# Altium schematic sheet POWER.SchDoc: =DocumentName
size 420 x 297 mm; CompanyName: "AS Manufacturing" LLC; Organization: "AS Manufacturing" LLC; Address1: 5 Sklyarenka St.; Address2: Kyiv 04073; Address3: Ukraine; Address4: https://ajax.systems/en/; DocumentNumber: 3; SheetNumber: 3; SheetTotal: 4; Template_version: 1.0.1
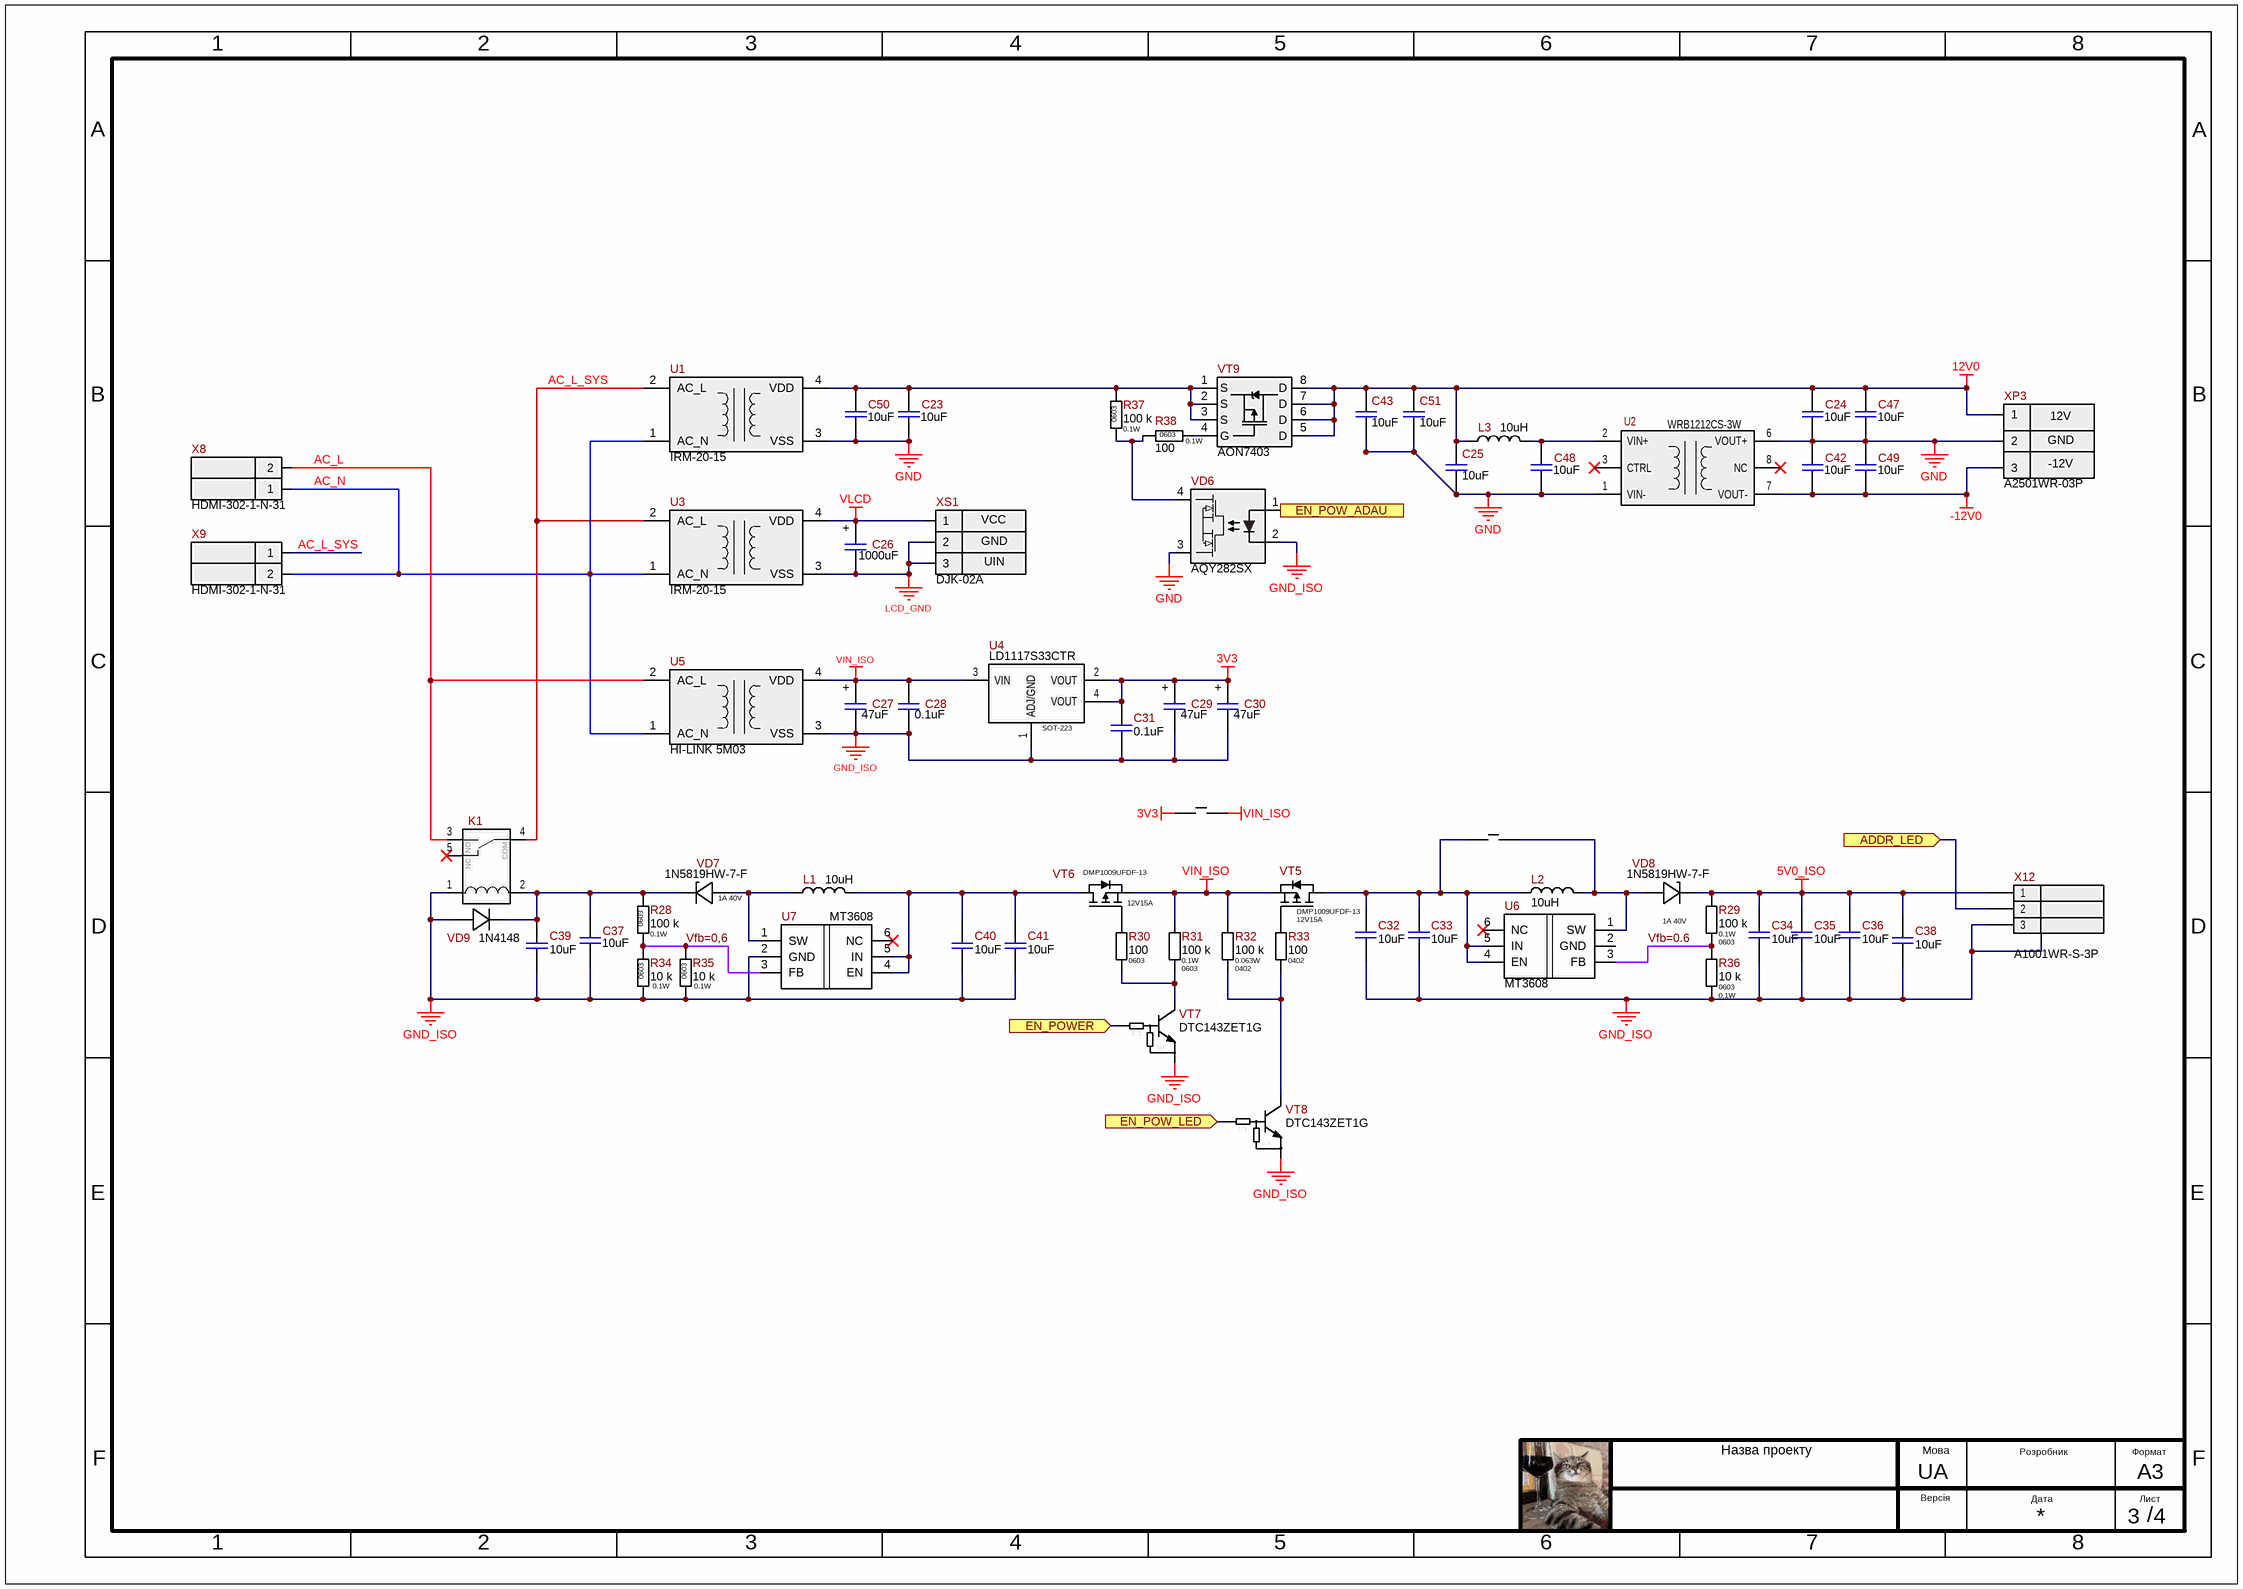
[diagram p0: POWER.SchDoc]

## Parts
C23  10uF  [C0805(2012)]
C24  10uF  [C0805(2012)]
C25  10uF  [C0805(2012)]
C26  1000uF  [CAP 10x16]
C27  47uF  [CASE_C(6032)]
C28  0.1uF  [C0603(1608)]
C29  47uF  [CASE_C(6032)]
C30  47uF  [CASE_C(6032)]
C31  0.1uF  [C0402(1005)]
C32  10uF  [C0805(2012)]
C33  10uF  [C0805(2012)]
C34  10uF  [C0805(2012)]
C35  10uF  [C0805(2012)]
C36  10uF  [C0805(2012)]
C37  10uF  [C0805(2012)]
C38  10uF  [C0805(2012)]
C39  10uF  [C0805(2012)]
C40  10uF  [C0805(2012)]
C41  10uF  [C0805(2012)]
C42  10uF  [C0805(2012)]
C43  10uF  [C0805(2012)]
C47  10uF  [C0805(2012)]
C48  10uF  [C0805(2012)]
C49  10uF  [C0805(2012)]
C50  10uF  [C0805(2012)]
C51  10uF  [C0805(2012)]
K1  LEG-12  [Relay10A]  (value not drawn)
L1  10uH  [WE-LQS SMD 4018]
L2  10uH  [WE-LQS SMD 4018]
L3  10uH  [WE-LQS SMD 4018]
R28  100 k  Power Rating: 0.1W  Package/Case: 0603  [R0603]
R29  100 k  Power Rating: 0.1W  Package/Case: 0603  [R0603]
R30  100  Package/Case: 0603  [R0603]
R31  100 k  Power Rating: 0.1W  Package/Case: 0603  [R0603]
R32  100 k  Power Rating: 0.063W  Package/Case: 0402  [R0402]
R33  100  Package/Case: 0402  [R0402]
R34  10 k  Package/Case: 0603  Power Rating: 0.1W  [R0603]
R35  10 k  Package/Case: 0603  Power Rating: 0.1W  [R0603]
R36  10 k  Package/Case: 0603  Power Rating: 0.1W  [R0603]
R37  100 k  Power Rating: 0.1W  Package/Case: 0603  [R0603]
R38  100  Power Rating: 0.1W  Package/Case: 0603  [R0603]
U1  IRM-20-15  [IRM-20-xx_REC]
U2  WRB1212CS-3W  [SIP-8 22.0x9.5x12.0mm 6pin]
U3  IRM-20-15  [IRM-20-xx_REC]
U4  Package: SOT-223  Part Number: LD1117S33CTR  [SOT223]  (hidden comment: LD1117STR)
U5  HI-LINK 5M03  [HLINK_5MXX]
U6  MT3608  [SOT23-6]
U7  MT3608  [SOT23-6]
VD6  AQY282SX  [SOP-4N]
VD7  1N5819HW-7-F  Power Rating: 1A 40V  [SOD-123]
VD8  1N5819HW-7-F  Power Rating: 1A 40V  [SOD-123]
VD9  1N4148  [SOD-80]
VT5  DMP1009UFDF-13  Power Rating: 12V15A  [U-DFN2020-6_SLDR]
VT6  DMP1009UFDF-13  Power Rating: 12V15A  [U-DFN2020-6_SLDR]
VT7  DTC143ZET1G  [SOT-416]
VT8  DTC143ZET1G  [SOT-416]
VT9  AON7403  [DFN3X3]
X8  Part Number: HDMI-302-1-N-31  [DG300-7.5-02P-13-02Z(H)]  (hidden comment: DG300-7.5-02P-13-02Z(H))
X9  Part Number: HDMI-302-1-N-31  [DG300-7.5-02P-13-02Z(H)]  (hidden comment: DG300-7.5-02P-13-02Z(H))
X10  Jumper 1.5х2  [NetTie1.5х2]  (value not drawn)  (net tie, no BOM)
X11  Jumper 1.5х2  [NetTie1.5х2]  (value not drawn)  (net tie, no BOM)
X12  A1001WR-S-3P  [A1001WR-S-03P]
XP3  A2501WR-03P  [A2501WR-03P]
XS1  DJK-02A  [DC-140-003]

## Ports
ADDR_LED (in), EN_POW_ADAU (in), EN_POW_LED (in), EN_POWER (in)

## Nets
3V3: C29.1 C30.1 C31.1 U4.2(VOUT) U4.4(VOUT) X10.1
5V0_ISO: C34.1 C35.1 C36.1 C38.1 R29.2 VD8.1(K) X12.1
12V0: C24.1 C25.1 C43.1 C47.1 C51.1 L3.2 VT9.5(D) VT9.6(D) VT9.7(D) VT9.8(D) XP3.1
-12V0: C42.2 C49.2 U2.7(VOUT-) XP3.3
GND: C23.2 C24.2 C25.2 C42.1 C43.2 C47.2 C48.2 C49.1 C50.2 C51.2 U1.3(VSS) U2.1(VIN-) U2.6(VOUT+) VD6.3 XP3.2
GND_ISO: C27.2 C28.2 C29.2 C30.2 C31.2 C32.2 C33.2 C34.2 C35.2 C36.2 C37.2 C38.2 C39.2 C40.2 C41.2 K1.1 R34.1 R35.1 R36.1 U4.1(ADJ/GND) U5.3(VSS) U7.2(GND) VD6.2(GND) VD9.2(A) VT7.2(E) VT8.2(E) X12.3 X12.MP(MountPad)
LCD_GND: C26.2 U3.3(VSS) XS1.2 XS1.3
VIN_ISO: C27.1 C28.1 R31.2 R32.2 U4.3(VIN) U5.4(VDD) VT5.S VT6.S X10.2
VLCD: C26.1 U3.4(VDD) XS1.1
AC_L: K1.3(NO) U5.2(AC_L) X8.2
AC_L_SYS: K1.4(COM) U1.2(AC_L) U3.2(AC_L) X9.1
AC_N: U1.1(AC_N) U3.1(AC_N) U5.1(AC_N) X8.1 X9.2
ADDR_LED: X12.2 ; port ADDR_LED
EN_POW_ADAU: VD6.1(VIN) ; port EN_POW_ADAU
EN_POW_LED: VT8.1(B) ; port EN_POW_LED
EN_POWER: VT7.1(B) ; port EN_POWER
Vfb=0,6: R28.1 R34.2 R35.2 U7.3(FB)
Vfb=0.6: R29.1 R36.2 U6.3(FB)
NetC23_1: C23.1 C50.1 R37.2 U1.4(VDD) VT9.1(S) VT9.2(S) VT9.3(S)
NetC32_1: C32.1 C33.1 L2.1 U6.4(EN) U6.5(IN) VT5.D X11.2
NetC37_1: C37.1 C39.1 K1.2 R28.2 VD7.1(K) VD9.1(K)
NetC40_1: C40.1 C41.1 L1.1 U7.4(EN) U7.5(IN) VT6.D
NetC48_1: C48.1 L3.1 U2.2(VIN+)
NetL1_2: L1.2 U7.1(SW) VD7.2(A)
NetL2_2: L2.2 U6.1(SW) VD8.2(A) X11.1
NetR30_1: R30.1 R31.1 VT7.3(C)
NetR30_2: R30.2 VT6.G
NetR32_1: R32.1 R33.1 VT8.3(C)
NetR33_2: R33.2 VT5.G
NetR37_1: R37.1 R38.2 VD6.4
NetR38_1: R38.1 VT9.4(G)

Not connected (* = marked no-connect by the designer): K1 5(NC)*; U2 3(CTRL)* 8(NC)*; U6 2(GND) 6(NC)*; U7 6(NC)*

## Notes on the sheet
- (near XP3) 12V
- (near XP3) GND
- (near XP3) -12V
- 1
- 2
- 3
- 4
- 5
- 6
- 7
- 8
- A
- B
- C
- D
- E
- F
- Назва проекту
- Мова
- UA
- Розробник
- Формат
- A3
- Версія
- Дата
- Лист
- /
- (in symbol 47uF  20V CASE-C) +
- (in symbol 1000uF  16V 10x16(EHR)) +
- (in symbol DJK-02A) VCC; GND; UIN
- (in symbol DTC143ZET1G) 4.7k; 47k

## Library data of the parts
C23-C25 C32-C43 C47-C51 = 10uF  16V C0805: CAP CER 10UF 16V X6S 0805; Manufacturer: Murata Electronics North America; Manufacturer P/N: GRM21BC81C106KA73L; Name Component: Capacitor Ceramic; Tolerance: ±10%; Operation Temperature: -55°C ~ 105°C; Library Path 1: Capacitors.SchLib; Part Number: 10uF  16V C0805; Value: 10uF; Temperature Coefficient: X6S; Power (V/A): 16V; Package/Case: C0805; Supplier 1: Digi-key; Supplier Part Number 1: 490-5519-2-ND; ComponentLink1Description: Datasheet; ComponentLink1URL: https://www.murata.com/~/media/webrenewal/support/library/catalog/products/capacitor/mlcc/c02e.ashx?la=en-us
C26 = 1000uF  16V 10x16(EHR): 1000uF 20% 16V EHR 10x16mm; Manufacturer: Hitano; Manufacturer P/N: EHR102M16BA; Name Component: Electrolytic capacitor; Operation Temperature: −40°C to +105°C; Library Path 1: Capacitors.SchLib; Part Number: 1000uF  16V 10x16(EHR); Value: 1000uF; Tolerance: ±20%; Power (V/A): 16V; Package/Case: 10x16(EHR); Supplier 1: RCS; ComponentLink1Description: Datasheet; ComponentLink1URL: https://www.rcscomponents.kiev.ua/datasheets/EHR_081225.pdf
C27 C29 C30 = 47uF  20V CASE-C: CAP TANT 47UF 10% 20V 2312; Manufacturer: KEMET; Manufacturer P/N: T491C476K020AT; Name Component: CapacitorTantalum; Operation Temperature: -55°C ~ 125°C; Library Path 1: Capacitors.SchLib; Part Number: 47uF  20V CASE-C; Value: 47uF; Tolerance: ±10%; Power (V/A): 20V; Package/Case: CASE-C; Temperature Coefficient: -; Supplier 1: Digi-key; Supplier Part Number 1: 399-10176-2-ND; ComponentLink1Description: Datasheet; ComponentLink1URL: https://content.kemet.com/datasheets/KEM_T2005_T491.pdf
C28 = 0.1uF  50V C0603: CAP CER 0.1UF 50V X7R 0603; Manufacturer: Samsung Electro-Mechanics; Manufacturer P/N: CL10B104KB8WPNC; Name Component: Capacitor Ceramic; Tolerance: ±10%; Operation Temperature: -55°C ~ 125°C; Library Path 1: Capacitors.SchLib; Notes: 06035C104K4T4A, 06035C104K4T2A; Part Number: 0.1uF  50V C0603; Value: 0.1uF; Temperature Coefficient: X7R; Power (V/A): 50V; Package/Case: C0603; Supplier Part Number 1: 1276-6854-2-ND; ComponentLink1Description: Datasheet; Supplier 1: Digi-key; ComponentLink1URL: https://www.samsungsem.com/resources/file/global/support/product_catalog/MLCC.pdf
C31 = 0.1uF  25V C0402: CAP CER 0.1UF 25V X7R 0402; Manufacturer: Samsung Electro-Mechanics; Name Component: Capacitor Ceramic; Tolerance: ±10%; Operation Temperature: -55°C ~ 125°C; Library Path 1: Capacitors.SchLib; Part Number: 0.1uF  25V C0402; Value: 0.1uF; Temperature Coefficient: X7R; Power (V/A): 25V; Package/Case: C0402; Supplier Part Number 1: 1276-6854-2-ND; ComponentLink1Description: Datasheet
K1 = LEG-12: General Purpose Relay, 1 Form C (1PDT), 12VDC 400Ohm Coil, 120VAC/24VDC @ 10A, 240VAC Max; Operation Temperature: -55°C ~ 125°C (TA); Power (V/A): 12V; Library Path 1: Others.SchLib; ComponentLink1URL: https://www.tme.eu/Document/311affc211749c2a4c93ad074af62b72/LEG-SERIES.pdf; ComponentLink1Description: Datasheet; Part Number: LEG-12; Name Component: Relay; Value: LEG-12; Supplier Part Number 1: Relay10A
L1-L3 = NRS4018T3R3: FIXED IND 10UH 1A 66 MOHM SMD; Manufacturer: TaiyoYuden; Manufacturer P/N: NRS4018T3R3MDGJ; Name Component: Fixed Inductors; Tolerance: ±20; Operation Temperature: -25°C ~ 120°C; Power (V/A): 2A; Library Path 1: Inductance.SchLib; Part Number: NRS4018T3R3; Value: 10uH; Package/Case: 4.00mm x 4.00mm; Supplier 1: Digi-key; Supplier Part Number 1: 587-2892-2-ND; ComponentLink1Description: Datasheet; ComponentLink1URL: https://www.yuden.co.jp/productdata/catalog/wound04_e.pdf
R28 R29 R31 R37 = 100 k  R0603: RES SMD 100 k OHM  ±1% 1/10W 0603; Name Component: Resistror; Operation Temperature: -55℃ to 155℃; Temperature Coefficient: ±100 ppm/°C; Library Path 1: Resistor.SchLib; Part Number: 100 k  R0603; Value: 100 k; Tolerance: ±1%
R30 = 100  R0603: RES SMD 100 OHM  ±1% 1/10W 0603; Power Rating: 0.1W; Name Component: Resistror; Operation Temperature: -55℃ to 155℃; Temperature Coefficient: ±100 ppm/°C; Library Path 1: Resistor.SchLib; Part Number: 100  R0603; Value: 100; Tolerance: ±1%
R32 = 100 k  R0402: RES SMD 100 k OHM  ±1% 1/16W 0402; Name Component: Resistror; Operation Temperature: -55℃ to 155℃; Temperature Coefficient: ±100 ppm/°C; Library Path 1: Resistor.SchLib; Part Number: 100 k  R0402; Value: 100 k; Tolerance: ±1%
R33 = 100  R0402: RES SMD 100 OHM  ±1% 1/16W 0402; Power Rating: 0.063W; Name Component: Resistror; Operation Temperature: -55℃ to 155℃; Temperature Coefficient: ±100 ppm/°C; Library Path 1: Resistor.SchLib; Part Number: 100  R0402; Value: 100; Tolerance: ±1%
R34-R36 = 10 k  R0603: RES SMD 10 k OHM  ±1% 1/10W 0603; Name Component: Resistror; Operation Temperature: -55℃ to 155℃; Temperature Coefficient: ±100 ppm/°C; Library Path 1: Resistor.SchLib; Part Number: 10 k  R0603; Value: 10 k; Tolerance: ±1%
R38 = 100  R0603: RES SMD 100 OHM  ±1% 1/10W 0603; Name Component: Resistror; Operation Temperature: -55℃ to 155℃; Temperature Coefficient: ±100 ppm/°C; Library Path 1: Resistor.SchLib; Part Number: 100  R0603; Value: 100; Tolerance: ±1%
U1 U3 = IRM-20-15: 15W 85-264V AC-DC PCB-Mount Green Power Module, 15V @ 1.4A; Operation Temperature: -40°C ~ 85°C; Power (V/A): 15 V 1.4A; Library Path 1: Module.SchLib; Part Number: IRM-20-15; Name Component: AC-DC; Value: IRM-20-15; ComponentLink1Description: Datasheet; ComponentLink1URL: https://kosmodrom.ua/storage/pdf/IRM-20.pdf
U2 = WRB1212CS-3W: 3W DC/DC Power Supply, Vout 12V, Size 22.0x9.5x12.0mm; Manufacturer: rlt; Part Number: {Part Number}; Value: *
U4 = LD1117S33CTR: IC REG LINEAR 3.3V 800MA SOT223; Manufacturer: STMicroelectronics; Name Component: Linear Regulators; Operation Temperature: -40°C ~ 125°C; Power (V/A): 0.8 A 3.3 В; Library Path 1: Power converters.SchLib; ComponentDescription: Linear Regulators  LD1117S33CTR  (SOT-223); Part Type: Power / Linear Regulator; Component Type: SMD; Temperature Range: 0°C ~ 125°C; ComponentLink1URL: https://www.st.com/content/ccc/resource/technical/document/datasheet/99/3b/7d/91/91/51/4b/be/CD00000544.pdf/files/CD00000544.pdf/jcr:content/translations/en.CD00000544.pdf; Supplier 1: Digi-key; Supplier Part Number 1: 497-1241-2-ND; Price: 0,11994941; ComponentLink1Description: Datasheet; Value: LD1117S33CTR; Package/Case: SOT-223; Manufacturer P/N: LD1117S33CTR
U5 = HI-LINK 5M03: 85-264VAC  5W 3.3V 1.5A; Name Component: AC-DC; Operation Temperature: -40°C ~ 85°C; Library Path 1: Module.SchLib; Part Number: HI-LINK 5M03; Value: HI-LINK 5M03; Power (V/A): 3.3 V 1.5A; ComponentLink1Description: Datasheet
U6 U7 = MT3608: HIGH EFFICIENCY 1.2MHZ 2A STEP UP CONVERTER; Manufacturer: AEROSEMI; Manufacturer P/N: MT3608 AEROSEMI; Name Component: Power converters; Operation Temperature: -40°C ~ 125°C; Library Path 1: Power converters.SchLib; ComponentDescription: Power converters  MT3608  (SOT23-6); Part Number: MT3608; Value: MT3608; Power (V/A): 2 A; Package/Case: SOT23-6; Supplier 1: -; Supplier Part Number 1: -; ComponentLink1Description: Datasheet; ComponentLink1URL: http://mini-tech.com.ua/download/datasheet/power_supply/MT3608.pdf
VD6 = AQY282SX: SSR RELAY SPST-NO 500MA 0-60V; Manufacturer: Panasonic Electric Works; Name Component: Optotransistor; Operation Temperature: -40 ~ +85; Power (V/A): 0 V ~ 60 V; Library Path 1: Opto.SchLib; Part Number: AQY282SX; Value: AQY282SX; Package/Case: 4-SOP; Supplier 1: Digi-key; ComponentLink1Description: Datasheet; ComponentLink1URL: https://media.digikey.com/pdf/Data%20Sheets/Panasonic%20Electric%20Works%20PDFs/AQW,AQY280,282,284.pdf
VD7 VD8 = 1N5819HW-7-F: DIODE SCHOTTKY 40V 1A SOD-123; Manufacturer: Diodes Incorporated; Library Path 1: Diodes.SchLib; Part Number: 1N5819HW-7-F; Name Component: Diode Schottky; Value: 1N5819HW-7-F; Package/Case: SOD-123; Supplier 1: Kosmodrom; ComponentLink1Description: Datasheet; ComponentLink1URL: https://www.mouser.com/datasheet/2/115/DIOD_S_A0011683586_1-2543674.pdf?srsltid=AfmBOooSNGKg6kFHsm5EDerUk8pACA_mvoqB5hN7nSVKhWQ3aDU_xIdt
VD9 = 1N4148: DIODE GEN PURP 75V 250MA SOD323; Manufacturer: Diodes Incorporated; Operation Temperature: -55°C ~ 150°C; Library Path 1: Diodes.SchLib; Power Rating: 75V 250mA; Part Number: 1N4148; Name Component: Diode; Value: 1N4148; Package/Case: SOD-80; Manufacturer P/N: 1N4148; Supplier 1: Digi-key; Supplier Part Number 1: 1N4148; ComponentLink1Description: Datasheet
VT5 VT6 = DMP1009UFDF-13: P-Channel 12 V 15A (Ta) 2W (Ta) Surface Mount U-DFN2020-6 (Type F); Manufacturer: Diodes Incorporated; Name Component: Transistor; Operation Temperature: -55°C ~ 150°C (TJ); Library Path 1: Transistors.SchLib; ComponentLink1URL: https://www.diodes.com/assets/Datasheets/DMP1009UFDF.pdf; ComponentLink1Description: Datasheet; Part Number: DMP1009UFDF-13; Value: DMP1009UFDF-13; Package/Case: U-DFN2020-6 (Type F); Manufacturer P/N: DMP1009UFDF-13; Supplier 1: Digi-key; Supplier Part Number 1: DMP1009UFDF-13-ND
VT7 VT8 = DTC143ZET1G: TRANS PREBIAS NPN 50V 100MA SC75; Manufacturer: onsemi; Name Component: Transistor; Operation Temperature: -55°C ~ 150°C (TJ); Power Rating: 100mA 50V; Library Path 1: Transistors.SchLib; Part Number: DTC143ZET1G; Value: DTC143ZET1G; Package/Case: SOT-416; Manufacturer P/N: DTC143ZET1G; Supplier 1: Digi-key; Supplier Part Number 1: DTC143ZET1GOSTR-ND; ComponentLink1Description: Datasheet; ComponentLink1URL: https://www.onsemi.com/pdf/datasheet/dtc143z-d.pdf
VT9 = AON7403: P-Channel 30 V 11A (Ta), 29A (Tc) 3.1W (Ta), 25W (Tc) Surface Mount 8-DFN-EP (3x3); Manufacturer: Alpha & Omega Semiconductor Inc.; Name Component: Transistor; Operation Temperature: -55°C ~ 150°C (TJ); Power Rating: 30V 15A; Library Path 1: Transistors.SchLib; Part Number: AON7403; ComponentLink1URL: https://imrad.com.ua/userdata/modules/productFiles/XwMaVOEl_AON7403_ao.pdf; ComponentLink1Description: Datasheet; Supplier 1: Digi-key; Supplier Part Number 1: 785-1581-2-ND; Value: AON7403; Package/Case: DFN3x3; Manufacturer P/N: AON7403
X8 X9 = HDMI-302-1-N-31: Screw Terminal, 7.5mm Pitch, 2 pin, Black; Manufacturer: Degson; Name Component: Power Connectors; Operation Temperature: -20...120°C; Power (V/A): 300 10A; Library Path 1: Connectors.SchLib; ComponentLink1URL: https://www.tme.eu/Document/ec81fb91e085f8fed6c76d9ebffab4bb/dg300-7.5.pdf; ComponentLink1Description: Datasheet; Value: DG300-7.5-02P-13-02Z(H)
X10 X11 = Jumper 1.5х2: Jumper 1.5mm x 2mm; Library Path 1: Others.SchLib; ComponentDescription: Jumper  Jumper 1.5х2  (1.5mm x 2mm); Part Number: Jumper 1.5х2; Name Component: Jumper; Value: Jumper 1.5х2; Package/Case: 1.5mm x 2mm; ComponentLink1Description: Datasheet; AbridgedComponentDescription: Jumper 1.5х2
X12 = A1001WR-S-3P: CONN HEADER 3POS 1MM; Manufacturer: Joint Tech; Ajax_1C_PN: NONE; Ajax_1С_Status: RND Only; Component Status: Review_1; Replacement: SM03B-SRSS-TB; Name Component: Rectangular Connectors - Headers; Operation Temperature: -25...85°C; Power (V/A): 1А 50В; Library Path 1: Connectors.SchLib; Part Type: Wire-to-Board / 1mm; Component Type: SMD; Temperature Range: -40°C ~ 105°C; ComponentLink1URL: https://www.tme.eu/Document/82e53032519d6eb0cf96ad88610f3e77/A1001WR-S-XP---12B5.pdf; Price: NONE; ComponentLink1Description: Datasheet; Part Number: A1001WR-S-3P; Value: A1001WR-S-3P; Package/Case: 1mm; Manufacturer P/N: A1001WR-S-3P; Supplier 1: Kosmodrom
XP3 = A2501WR-03P: PIN: 3; A2501; 3A; 250V; UL94V-0; Manufacturer: JOINT TECH; Name Component: Power Connectors; Operation Temperature: -40°C ~ 80°C; Library Path 1: Connectors.SchLib; Part Number: A2501WR-03P; Value: A2501WR-03P; Supplier 1: RCS; ComponentLink1Description: Datasheet; ComponentLink1URL: https://documents.tme.eu/v7/_solaris-tep_/pVersion=0046&contRep=ZT&docId=005056AB752F1EE383C6617DFE942CAD&compId=A2501WV-XP.pdf?ci_sign=9baf55e1d4ede3a69cd97522aa56fece6c405150
XS1 = DJK-02A: DC POWER JACK CONNECTOR 6.3MM; Manufacturer: KLS; Name Component: Power socket; Operation Temperature: -25°C ~ 85°C; Power (V/A): 2A/250V; Library Path 1: Connectors.SchLib; Part Number: DJK-02A; Value: DJK-02A; Package/Case: DJK-02A; Manufacturer P/N: DJK-02A; Supplier 1: -; ComponentLink1Description: Datasheet; ComponentLink1URL: https://static.chipdip.ru/lib/078/DOC001078433.pdf; System: Connector